# Altium schematic sheet [05] - AUDIO.SchDoc
size A3; DocumentNumber: 5; SheetNumber: 5; SheetTotal: 5
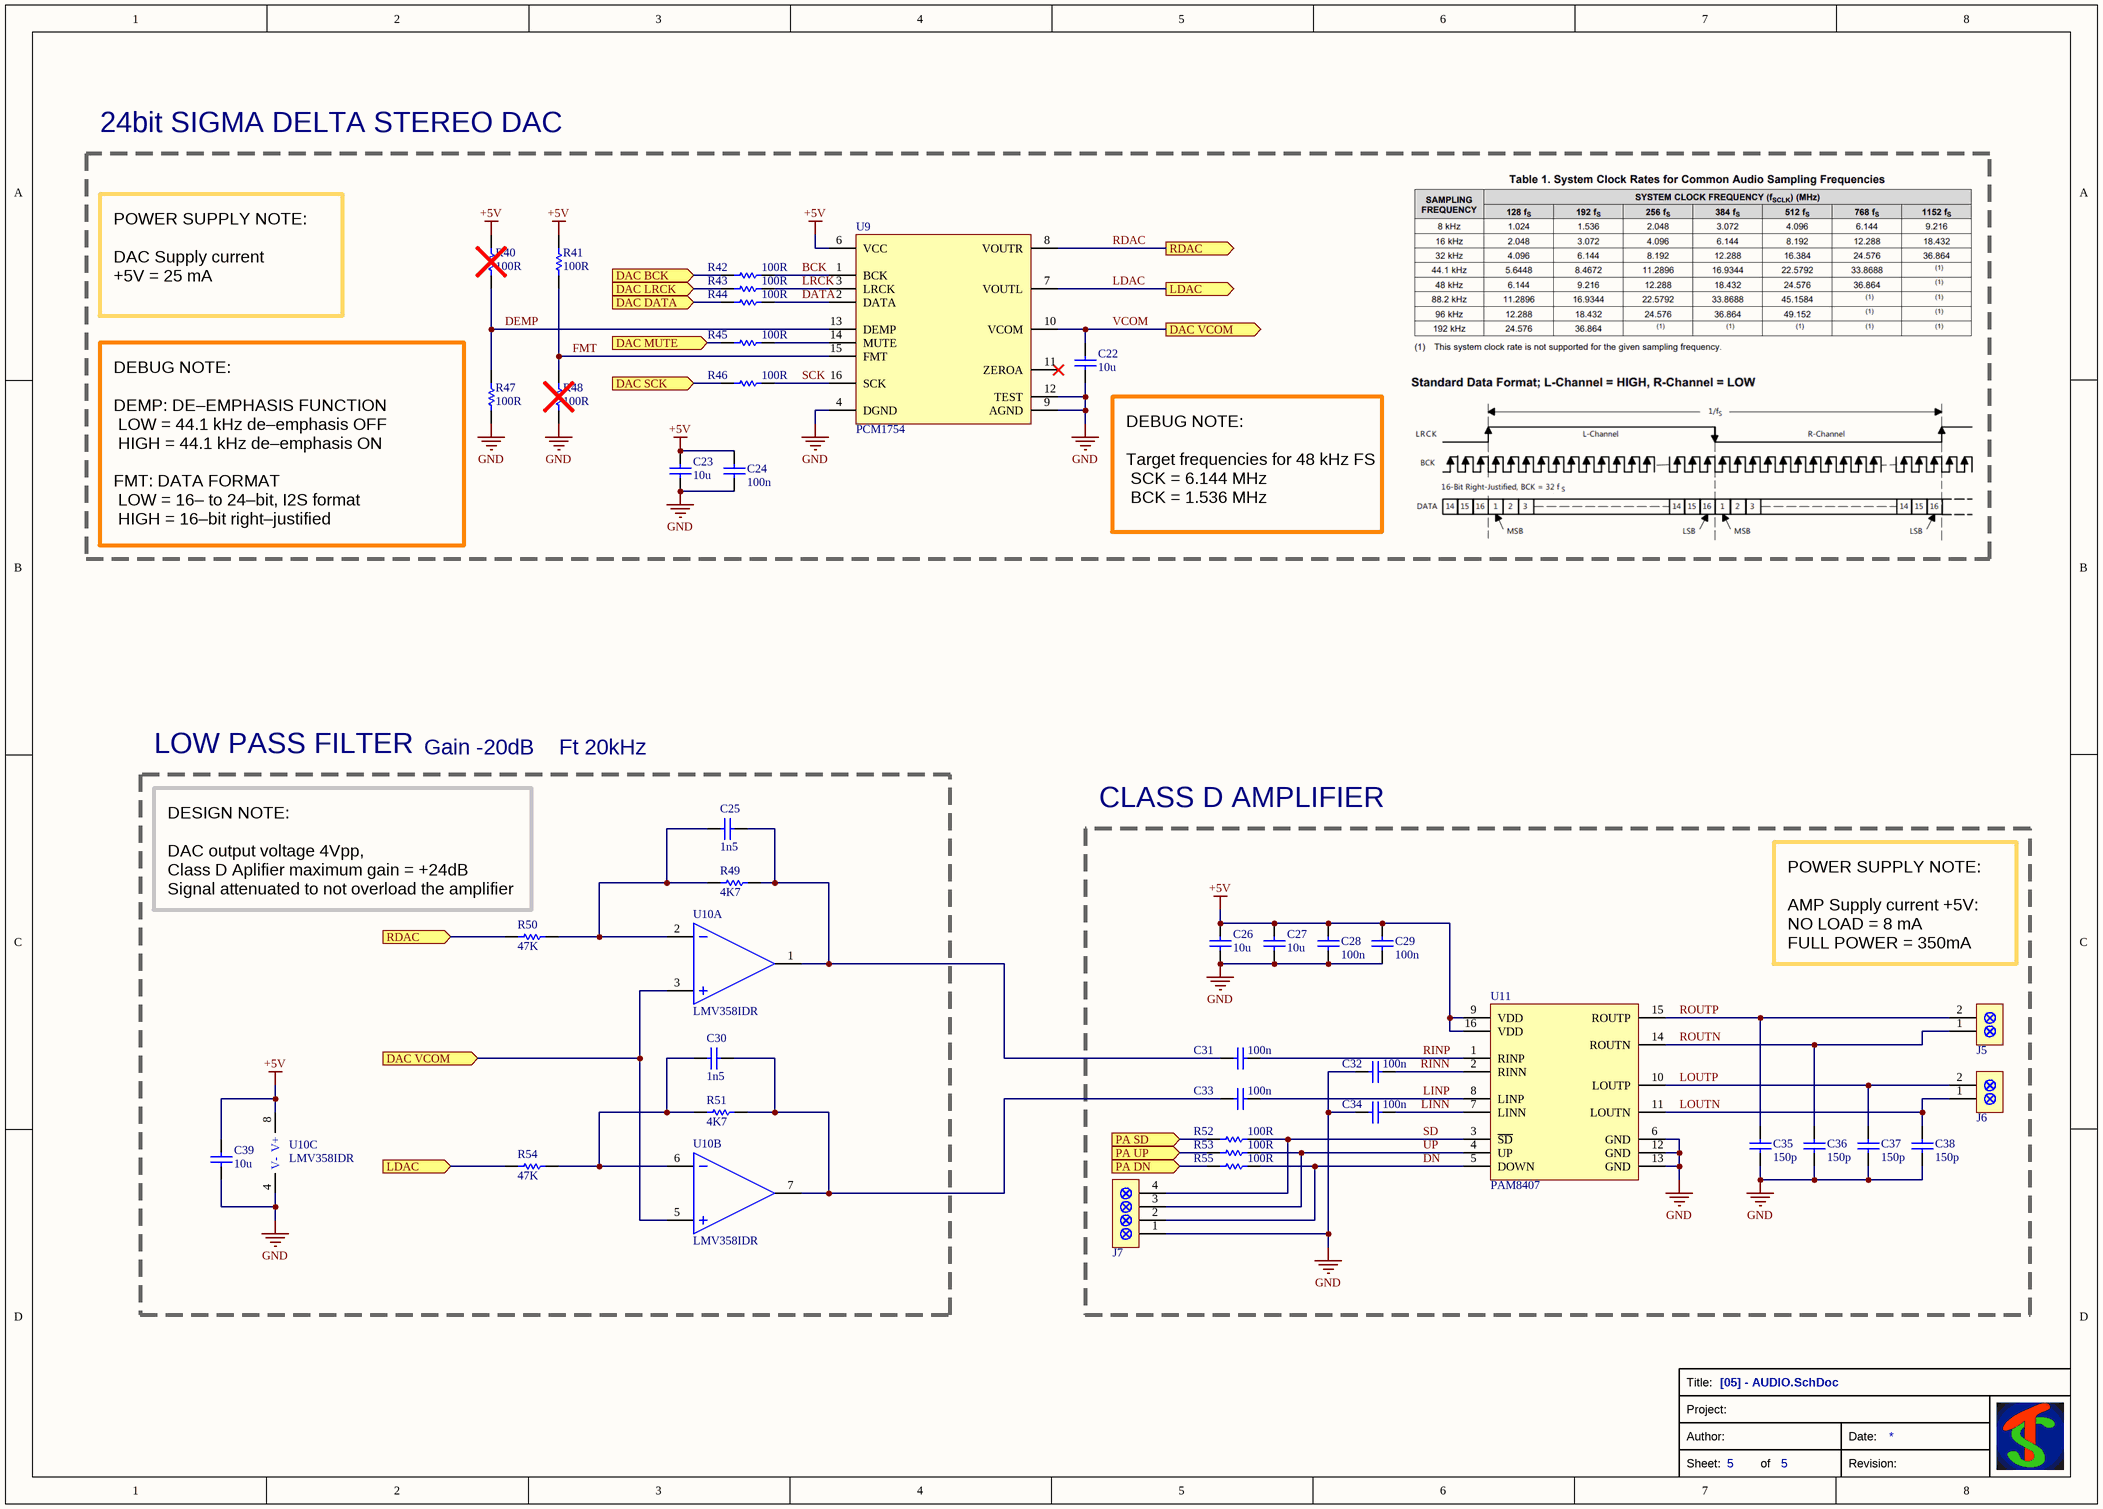
[diagram p0: [05] - AUDIO.SchDoc]

## Parts
C22  value 10u  [CAP-0805]  (hidden comment: CL21A106KAYNNN)
C23  value 10u  [CAP-0805]  (hidden comment: CL21A106KAYNNN)
C24  value 100n  [CAP-0603]  (hidden comment: C0603C104M4RAC)
C25  value 1n5  [CAP-0603]  (hidden comment: GRM1885C1H152JA01J)
C26  value 10u  [CAP-0805]  (hidden comment: CL21A106KAYNNN)
C27  value 10u  [CAP-0805]  (hidden comment: CL21A106KAYNNN)
C28  value 100n  [CAP-0603]  (hidden comment: C0603C104M4RAC)
C29  value 100n  [CAP-0603]  (hidden comment: C0603C104M4RAC)
C30  value 1n5  [CAP-0603]  (hidden comment: GRM1885C1H152JA01J)
C31  value 100n  [CAP-0603]  (hidden comment: C0603C104M4RAC)
C32  value 100n  [CAP-0603]  (hidden comment: C0603C104M4RAC)
C33  value 100n  [CAP-0603]  (hidden comment: C0603C104M4RAC)
C34  value 100n  [CAP-0603]  (hidden comment: C0603C104M4RAC)
C35  value 150p  [CAP-0805]  (hidden comment: 885012007083)
C36  value 150p  [CAP-0805]  (hidden comment: 885012007083)
C37  value 150p  [CAP-0805]  (hidden comment: 885012007083)
C38  value 150p  [CAP-0805]  (hidden comment: 885012007083)
C39  value 10u  [CAP-0805]  (hidden comment: CL21A106KAYNNN)
J5  SCREW-TH-BLOCK-200-2  [SCREW-TH-BLOCK-200-2]  (value not drawn)
J6  SCREW-TH-BLOCK-200-2  [SCREW-TH-BLOCK-200-2]  (value not drawn)
J7  SCREW-TH-BLOCK-200-4  [SCREW-TH-BLOCK-200-4]  (value not drawn)
R40  value 100R  [RES-0603]  (hidden comment: RC0603FR-07100RL)
R41  value 100R  [RES-0603]  (hidden comment: RC0603FR-07100RL)
R42  value 100R  [RES-0603]  (hidden comment: RC0603FR-07100RL)
R43  value 100R  [RES-0603]  (hidden comment: RC0603FR-07100RL)
R44  value 100R  [RES-0603]  (hidden comment: RC0603FR-07100RL)
R45  value 100R  [RES-0603]  (hidden comment: RC0603FR-07100RL)
R46  value 100R  [RES-0603]  (hidden comment: RC0603FR-07100RL)
R47  value 100R  [RES-0603]  (hidden comment: RC0603FR-07100RL)
R48  value 100R  [RES-0603]  (hidden comment: RC0603FR-07100RL)
R49  value 4K7  [RES-0603]  (hidden comment: RC0603FR-074K7L)
R50  value 47K  [RES-0603]  (hidden comment: RC0603FR-0747KL)
R51  value 4K7  [RES-0603]  (hidden comment: RC0603FR-074K7L)
R52  value 100R  [RES-0603]  (hidden comment: RC0603FR-07100RL)
R53  value 100R  [RES-0603]  (hidden comment: RC0603FR-07100RL)
R54  value 47K  [RES-0603]  (hidden comment: RC0603FR-0747KL)
R55  value 100R  [RES-0603]  (hidden comment: RC0603FR-07100RL)
U9  PCM1754  [SOP64P600X175-16N]
U10  LMV358IDR  [SOIC127P600X175-8N]  (parts A,B,C of 3)
U11  PAM8407  [SOIC127P600X175-16N]

## Blocks framed on the sheet
24bit SIGMA DELTA STEREO DAC: C22-C24 R40-R48 U9
LOW PASS FILTER: C25 C30 C39 R49-R51 R54 U10
CLASS D AMPLIFIER: C26-C29 C31-C38 J5-J7 R52 R53 R55 U11

## Ports
DAC BCK (in), DAC DATA (in), DAC LRCK (in), DAC MUTE (in), DAC SCK (in), DAC VCOM (in), DAC VCOM (out), LDAC (in), LDAC (out), PA DN (in), PA SD (in), PA UP (in), RDAC (in), RDAC (out)

## Nets
+5V: C23.1 C24.2 C26.1 C27.1 C28.2 C29.2 C39.1 R40.2 R41.2 U9.6(VCC) U10.8(V+) U11.9(VDD) U11.16(VDD)
GND: C22.2 C23.2 C24.1 C26.2 C27.2 C28.1 C29.1 C32.1 C34.1 C35.1 C36.1 C37.1 C38.1 C39.2 J7.1 R47.1 R48.1 U9.4(DGND) U9.9(AGND) U9.12(TEST) U10.4(V-) U11.6(GND) U11.12(GND) U11.13(GND)
BCK: R42.2 U9.1(BCK)
DAC BCK: R42.1 ; port DAC BCK
DAC DATA: R44.1 ; port DAC DATA
DAC LRCK: R43.1 ; port DAC LRCK
DAC MUTE: R45.1 ; port DAC MUTE
DAC SCK: R46.1 ; port DAC SCK
DATA: R44.2 U9.2(DATA)
DEMP: R40.1 R47.2 U9.13(DEMP)
DN: J7.2 R55.2 U11.5(DOWN)
FMT: R41.1 R48.2 U9.15(FMT)
LDAC: R54.2 U9.7(VOUTL) ; port LDAC
LINN: C34.2 U11.7(LINN)
LINP: C33.2 U11.8(LINP)
LOUTN: C38.2 J6.1 U11.11(LOUTN)
LOUTP: C37.2 J6.2 U11.10(LOUTP)
LRCK: R43.2 U9.3(LRCK)
PA DN: R55.1 ; port PA DN
PA SD: R52.1 ; port PA SD
PA UP: R53.1 ; port PA UP
RDAC: R50.2 U9.8(VOUTR) ; port RDAC
RINN: C32.2 U11.2(RINN)
RINP: C31.2 U11.1(RINP)
ROUTN: C36.2 J5.1 U11.14(ROUTN)
ROUTP: C35.2 J5.2 U11.15(ROUTP)
SCK: R46.2 U9.16(SCK)
SD: J7.4 R52.2 U11.3(~{SD})
UP: J7.3 R53.2 U11.4(UP)
VCOM: C22.1 U9.10(VCOM) U10.3(1IN+) U10.5(2IN+) ; port DAC VCOM
NetC25_1: C25.1 R49.1 R50.1 U10.2(1IN-)
NetC25_2: C25.2 C31.1 R49.2 U10.1(1OUT)
NetC30_1: C30.1 R51.1 R54.1 U10.6(2IN-)
NetC30_2: C30.2 C33.1 R51.2 U10.7(2OUT)
NetR45_2: R45.2 U9.14(MUTE)

Not connected (* = marked no-connect by the designer): U9 11(ZEROA)*

## Notes on the sheet
- POWER SUPPLY NOTE:
  DAC Supply current
  +5V	= 25 mA
- DEBUG NOTE:
  Target frequencies for 48 kHz FS
  SCK = 6.144 MHz
  BCK = 1.536 MHz
- (near R47) DEBUG NOTE:
  DEMP: DE–EMPHASIS FUNCTION
  LOW = 44.1 kHz de–emphasis OFF
  HIGH = 44.1 kHz de–emphasis ON
  FMT: DATA FORMAT
  LOW = 16– to 24–bit, I2S format
  HIGH = 16–bit right–justified
- Gain -20dB
- Ft 20kHz
- (near R50) DESIGN NOTE:
  DAC output voltage 4Vpp,
  Class D Aplifier maximum gain = +24dB
  Signal attenuated to not overload the amplifier
- POWER SUPPLY NOTE:
  AMP Supply current +5V:
  NO LOAD = 8 mA
  FULL POWER = 350mA
- Title:
- Project:
- Sheet:
- Author:
- of
- Revision:
- Date:

## Library data of the parts
C22 C23 C26 C27 C39 = CAP-0805-10u-25V-X5R-10%: MLCC - SMD 25V 10uF X5R 10%; Manufacturer: Samsung; Voltage Rating: 25; Tolerance: 10%; Dielectric: X5R; Supplier 1: Mouser; Supplier Part Number 1: 187-CL21A106KAYNNNE
C24 C28 C29 C31-C34 = CAP-0603-100n-16V-X7R-20%: MLCC - SMD 16V 100nF X7R 0603 20%; Manufacturer: KEMET; Tolerance: 20%; Dielectric: X7R; Supplier 1: Mouser; Supplier Part Number 1: 80-C0603C104M4RAC; Voltage Rating: 16V
C25 C30 = CAP-0603-1n5-50V-NP0-5%: MLCC - SMD 50V 1.5nF NP0 0603 5%; Manufacturer: Murata; Voltage Rating: 50V; Tolerance: 5%; Dielectric: NP0; Supplier 1: Mouser; Supplier Part Number 1: 81-GRM185C1H152JA01J
C35-C38 = CAP-0805-150p-100V-NP0-5%: MLCC - SMD 100V 150pF NP0 0805 5%; Manufacturer: Wurth Electronics; Supplier 1: Mouser; Supplier Part Number 1: 710-885012007083; Voltage Rating: 100V; Dielectric: NP0; Tollerance: 5%
J5 J6 = SCREW-TH-BLOCK-200-2: Screw Therminal Block 200 mil Pitch 2 Contacts
J7 = SCREW-TH-BLOCK-200-4: Screw Therminal Block 200 mil Pitch 4 Contacts
R40-R48 R52 R53 R55 = RES-0603-100R-1/10W-1%: Thick Film - SMD 75V 1/10W 100 ohm 0603 1%; Manufacturer: Yageo; Power Rating: 1/10W; Voltage Rating: 75V; Tolerance: 1%; Supplier 1: Mouser; Supplier Part Number 1: 603-RC0603FR-07100RL; Supplier 2: Mouser; Supplier 3: Mouser; Supplier Part Number 3: 603-RC0603FR-13100RL; Supplier Part Number 2: 603-RC0603FR-10100RL
R49 R51 = RES-0603-4K7-1/10W-1%: Thick Film - SMD 75V 1/10W 4.7K ohm 0603 1%; Manufacturer: Yageo; Power Rating: 1/10W; Voltage Rating: 75V; Tolerance: 1%; Supplier 1: Mouser; Supplier 2: Mouser; Supplier 3: Mouser; Supplier Part Number 3: 603-RC0603FR-134K7L; Supplier Part Number 2: 603-RC0603FR-104K7L; Supplier Part Number 1: 603-RC0603FR-074K7L
R50 R54 = RES-0603-47K-1/10W-1%: Thick Film - SMD 75V 1/10W 47K ohm 0603 1%; Manufacturer: Yageo; Power Rating: 1/10W; Voltage Rating: 75V; Tolerance: 1%; Supplier 1: Mouser; Supplier Part Number 1: 603-RC0603FR-0747KL; Supplier 2: Mouser; Supplier 3: Mouser; Supplier Part Number 3: 603-RC0603FR-1347KL; Supplier Part Number 2: 603-RC0603FR-1047KL
U9 = DAC-STEREO-24bit-PCM1754: Circuiti integrati convertitori D/A audio 24-Bit 192kHz Stereo Audio DAC; Supplier 1: Mouser; Supplier Part Number 1: 595-PCM1754DBQR
U10 = OPAMP-FET-LMV358IDR-TI: Low-Voltage Rail-to-Rail Output FET Input Dual Operational Amplifier; Manufacturer: Texas Instruments; Supplier 1: Mouser; Supplier Part Number 1: 595-LMV358IDR
U11 = PAM8407: 2x3W Stereo Differential Input Class D Audio Amplifier / with Up/Down Volume Control; Supplier 1: Mouser; Supplier Part Number 1: 621-PAM8407DR